# Altium schematic sheet MCU.SchDoc
size A
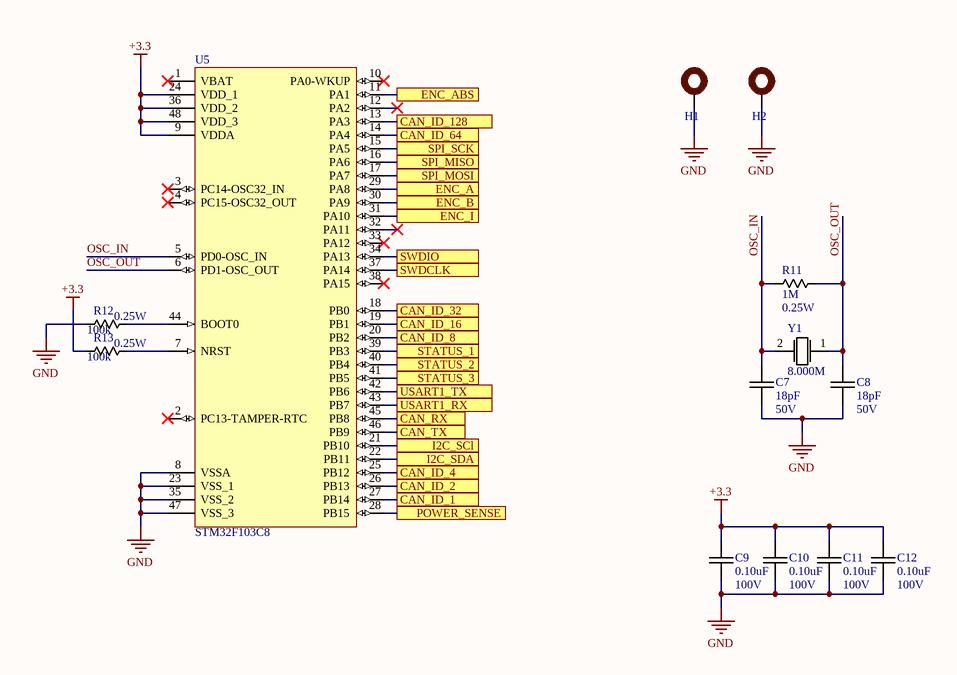
[diagram p0: MCU.SchDoc]

## Parts
C7  Capacitance: 18pF  Voltage Rating: 50V  [chip_0603]  (hidden comment: cap_single_np)
C8  Capacitance: 18pF  Voltage Rating: 50V  [chip_0603]  (hidden comment: cap_single_np)
C9  Capacitance: 0.10uF  Voltage Rating: 100V  [chip_0805]  (hidden comment: cap_single_np)
C10  Capacitance: 0.10uF  Voltage Rating: 100V  [chip_0805]  (hidden comment: cap_single_np)
C11  Capacitance: 0.10uF  Voltage Rating: 100V  [chip_0805]  (hidden comment: cap_single_np)
C12  Capacitance: 0.10uF  Voltage Rating: 100V  [chip_0805]  (hidden comment: cap_single_np)
H1  mounting_hole_0  [#8-32_SOCKET_HEAD]  (value not drawn)
H2  mounting_hole_0  [#8-32_SOCKET_HEAD]  (value not drawn)
R11  Resistance: 1M  Power Rating: 0.25W  [chip_0603]  (hidden comment: res_single)
R12  Resistance: 100k  Power Rating: 0.25W  [chip_0603]  (hidden comment: res_single)
R13  Resistance: 100k  Power Rating: 0.25W  [chip_0603]  (hidden comment: res_single)
U5  STM32F103C8  [LQFP48_0]
Y1  Frequency: 8.000M  [ABLS_AT49_OSC]  (hidden comment: osc_xtal_2p_0)

## Ports
CAN_ID_1, CAN_ID_2, CAN_ID_4, CAN_ID_8, CAN_ID_16, CAN_ID_32, CAN_ID_64, CAN_ID_128, CAN_RX, CAN_TX, ENC_A, ENC_ABS, ENC_B, ENC_I, I2C_SCl, I2C_SDA, POWER_SENSE, SPI_MISO, SPI_MOSI, SPI_SCK, STATUS_1, STATUS_2, STATUS_3, SWDCLK, SWDIO, USART1_RX, USART1_TX

## Nets
+3.3: C9.1 C10.1 C11.1 C12.1 R13.2 U5.9(VDDA) U5.24(VDD_1) U5.36(VDD_2) U5.48(VDD_3)
GND: C7.2 C8.2 C9.2 C10.2 C11.2 C12.2 H1.0(A) H2.0(A) R12.2 U5.8(VSSA) U5.23(VSS_1) U5.35(VSS_2) U5.47(VSS_3)
CAN_ID_1: U5.27(PB14) ; port CAN_ID_1
CAN_ID_2: U5.26(PB13) ; port CAN_ID_2
CAN_ID_4: U5.25(PB12) ; port CAN_ID_4
CAN_ID_8: U5.20(PB2) ; port CAN_ID_8
CAN_ID_16: U5.19(PB1) ; port CAN_ID_16
CAN_ID_32: U5.18(PB0) ; port CAN_ID_32
CAN_ID_64: U5.14(PA4) ; port CAN_ID_64
CAN_ID_128: U5.13(PA3) ; port CAN_ID_128
CAN_RX: U5.45(PB8) ; port CAN_RX
CAN_TX: U5.46(PB9) ; port CAN_TX
ENC_A: U5.29(PA8) ; port ENC_A
ENC_ABS: U5.11(PA1) ; port ENC_ABS
ENC_B: U5.30(PA9) ; port ENC_B
ENC_I: U5.31(PA10) ; port ENC_I
I2C_SCl: U5.21(PB10) ; port I2C_SCl
I2C_SDA: U5.22(PB11) ; port I2C_SDA
OSC_IN: C7.1 R11.1 U5.5(PD0-OSC_IN) Y1.2
OSC_OUT: C8.1 R11.2 U5.6(PD1-OSC_OUT) Y1.1
POWER_SENSE: U5.28(PB15) ; port POWER_SENSE
SPI_MISO: U5.16(PA6) ; port SPI_MISO
SPI_MOSI: U5.17(PA7) ; port SPI_MOSI
SPI_SCK: U5.15(PA5) ; port SPI_SCK
STATUS_1: U5.39(PB3) ; port STATUS_1
STATUS_2: U5.40(PB4) ; port STATUS_2
STATUS_3: U5.41(PB5) ; port STATUS_3
SWDCLK: U5.37(PA14) ; port SWDCLK
SWDIO: U5.34(PA13) ; port SWDIO
USART1_RX: U5.43(PB7) ; port USART1_RX
USART1_TX: U5.42(PB6) ; port USART1_TX
NetR12_1: R12.1 U5.44(BOOT0)
NetR13_1: R13.1 U5.7(NRST)

Not connected (* = marked no-connect by the designer): U5 1(VBAT)* 2(PC13-TAMPER-RTC)* 3(PC14-OSC32_IN)* 4(PC15-OSC32_OUT)* 10(PA0-WKUP)* 12(PA2)* 32(PA11)* 33(PA12)* 38(PA15)*

## Library data of the parts
C7 C8 = CAP-00417: CAP, 18pF, ±1%, 50V, C0G, 0603; Manufacturer: Murata; Manufacturer PN: GRM1885C1H180FA01J; Tolerance: ±1%; Part Number: CAP-00417; Type: C0G
C9-C12 = CAP-00073: CAP, 0.10uF, 10%, 100V, X7R, 0805; Manufacturer: Murata; Manufacturer PN: GRM21BR72A104KAC4L; Tolerance: 10%; Part Number: CAP-00073; Type: X7R
H1 H2 = MISC-00027: #8-32 Mounting Hole for Socket Head Cap Screw; Part Number: MISC-00027
R11 = RES-00362: RES SMD 1M OHM 1% 1/4W 0603; Manufacturer: Panasonic; Manufacturer PN: ERJ-PA3F1004V; Tolerance: 1%; Part Number: RES-00362
R12 R13 = RES-00301: RES SMD 100K OHM 1% 1/4W 0603; Manufacturer: Panasonic; Manufacturer PN: ERJ-PA3F1003V; Tolerance: 1%; Part Number: RES-00301
U5 = UCTRL-00008: STM32 M3, LQFP-48; Manufacturer: ST; Manufacturer PN: STM32F103C8; Part Number: UCTRL-00008
Y1 = OSC-00002: XTAL, 8MHz, 18pF, 20ppm; Manufacturer: Abracon; Manufacturer PN: ABLS-8.000MHZ-B2-T; ESR: 80; Stability: 50ppm; Load Capacitance: 18pF; Tolerance: 20ppm; Part Number: OSC-00002